# EAGLE design bodenfeuchte_1 (EAGLE 6.5.0)
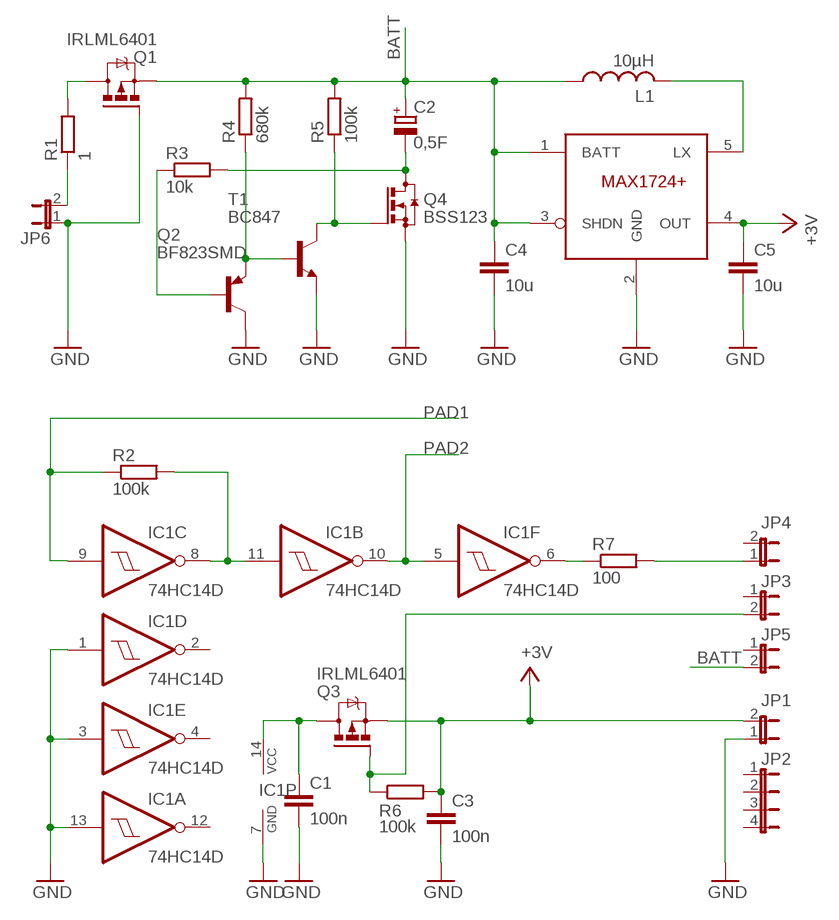
[diagram p0: schematic, sheet 1]

## Parts
C1  100n  C-EUC0805  [C0805]
C2  0,5F  CPOL-EUTAP5-80  [GOLDCAP5-21.5]
C3  100n  C-EUC0805  [C0805]
C4  10u  C-EUC0805  [C0805]
C5  10u  C-EUC0805  [C0805]
IC1  74HC14D  [SO14]
JP1  JP1E  [JP1]
JP2  JP4E  [JP4]
JP3  JP1E  [JP1]
JP4  JP1E  [JP1]
JP5  JP1E  [JP1]
JP6  JP1E  [JP1]
L1  10µH  L-USL1812  [L1812]
Q1  IRLML6401  IRLML5203  [MICRO3]
Q2  BF823SMD  [SOT23-BEC]
Q3  IRLML6401  IRLML5203  [MICRO3]
Q4  BSS123  [SOT23]
R1  1  R-EU_R0805  [R0805]
R2  100k  R-EU_R0805  [R0805]
R3  10k  R-EU_R0805  [R0805]
R4  680k  R-EU_R0805  [R0805]
R5  100k  R-EU_R0805  [R0805]
R6  100k  R-EU_R0805  [R0805]
R7  100  R-EU_R0805  [R0805]
T1  BC847  [SOT23]
U$1  MAX1724  [SOT23-5L]

## Nets
BATT: C2.+ C4.1 JP5.2 L1.1 Q1.2(S) R4.2 R5.2 U$1.1(BATT) U$1.3(SHDN)
GND: C1.2 C3.2 C4.2 C5.2 IC1.1(D:I) IC1.3(E:I) IC1.7(P:GND) IC1.13(A:I) JP1.1 JP6.1 Q1.1(G) Q2.C Q4.2(S) T1.2(E) U$1.2(GND)
N$2: IC1.8(C:O) IC1.11(B:I) R2.2
N$4: IC1.6(F:O) R7.1
N$5: JP4.1 R7.2
N$7: JP3.2 Q3.1(G) R6.1
N$8: C1.1 IC1.14(P:VCC) Q3.3(D)
N$11: Q4.1(G) R5.1 T1.3(C)
N$12: Q2.E R4.1 T1.1(B)
N$13: C2.- Q4.3(D) R3.2
N$14: Q2.B R3.1
N$15: JP6.2 R1.1
N$16: Q1.3(D) R1.2
N$21: L1.2 U$1.5(LX)
PAD1: IC1.9(C:I) R2.1
PAD2: IC1.5(F:I) IC1.10(B:O)
V+: C3.1 C5.1 JP1.2 Q3.2(S) R6.2 U$1.4(OUT) ; supply symbol labelled +3V
Unconnected: IC1.2(D:O) IC1.4(E:O) IC1.12(A:O) JP2.1 JP2.2 JP2.3 JP2.4 JP3.1 JP4.2 JP5.1

## Library data of the parts
C1 C3 = resistor:C-EU: CAPACITOR, European symbol
C2 = resistor:CPOL-EU: POLARIZED CAPACITOR, European symbol
C4 C5 = rcl:C-EU: CAPACITOR, European symbol
IC1 = 74xx-eu:74*14: Hex schmitt trigger INVERTER
JP1 JP3-JP6 = jumper:JP1E: JUMPER
JP2 = jumper:JP4E: JUMPER
L1 = resistor:L-US: INDUCTOR, American symbol
Q1 Q3 = transistor-power:IRLML5203: HEXFET P-Channel Power MOSFET
Q2 = transistor-pnp:BF823*: PNP Transistror
Q4 = transistor-small-signal:BSS123: N-CHANNEL MOS FET
R1-R7 = resistor:R-EU_: RESISTOR, European symbol
T1 = transistor-neu-to92:BC847: NPN TRANSISTOR
U$1 = MAX1724:MAX1724

## Board
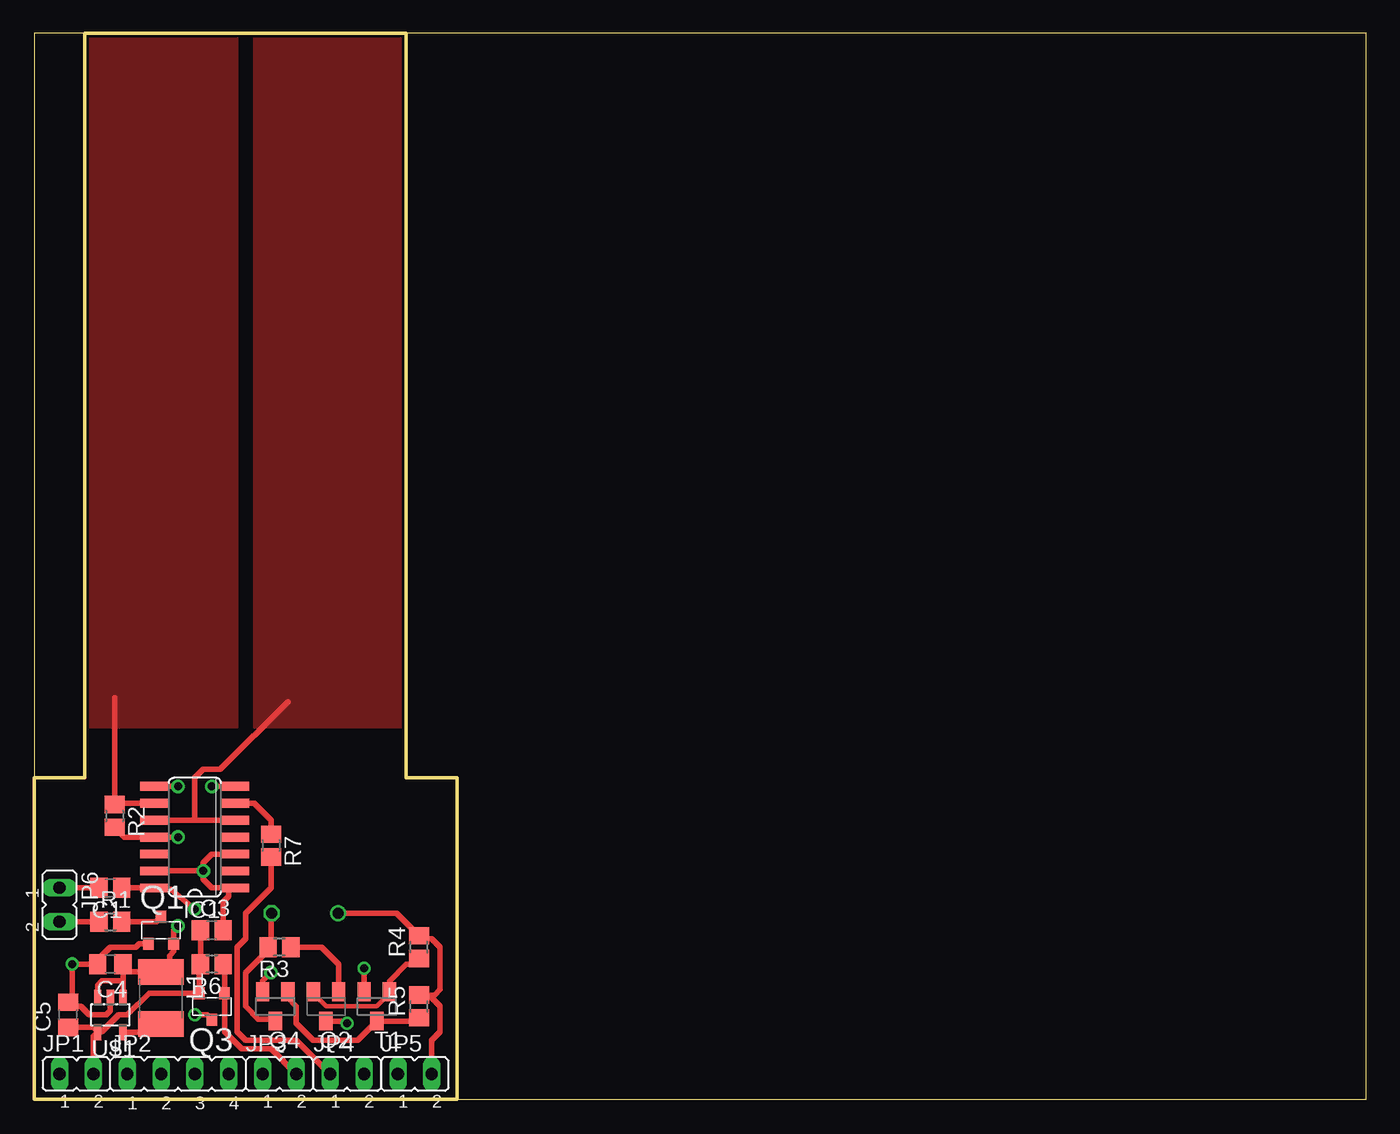
[diagram p1: board, top side]
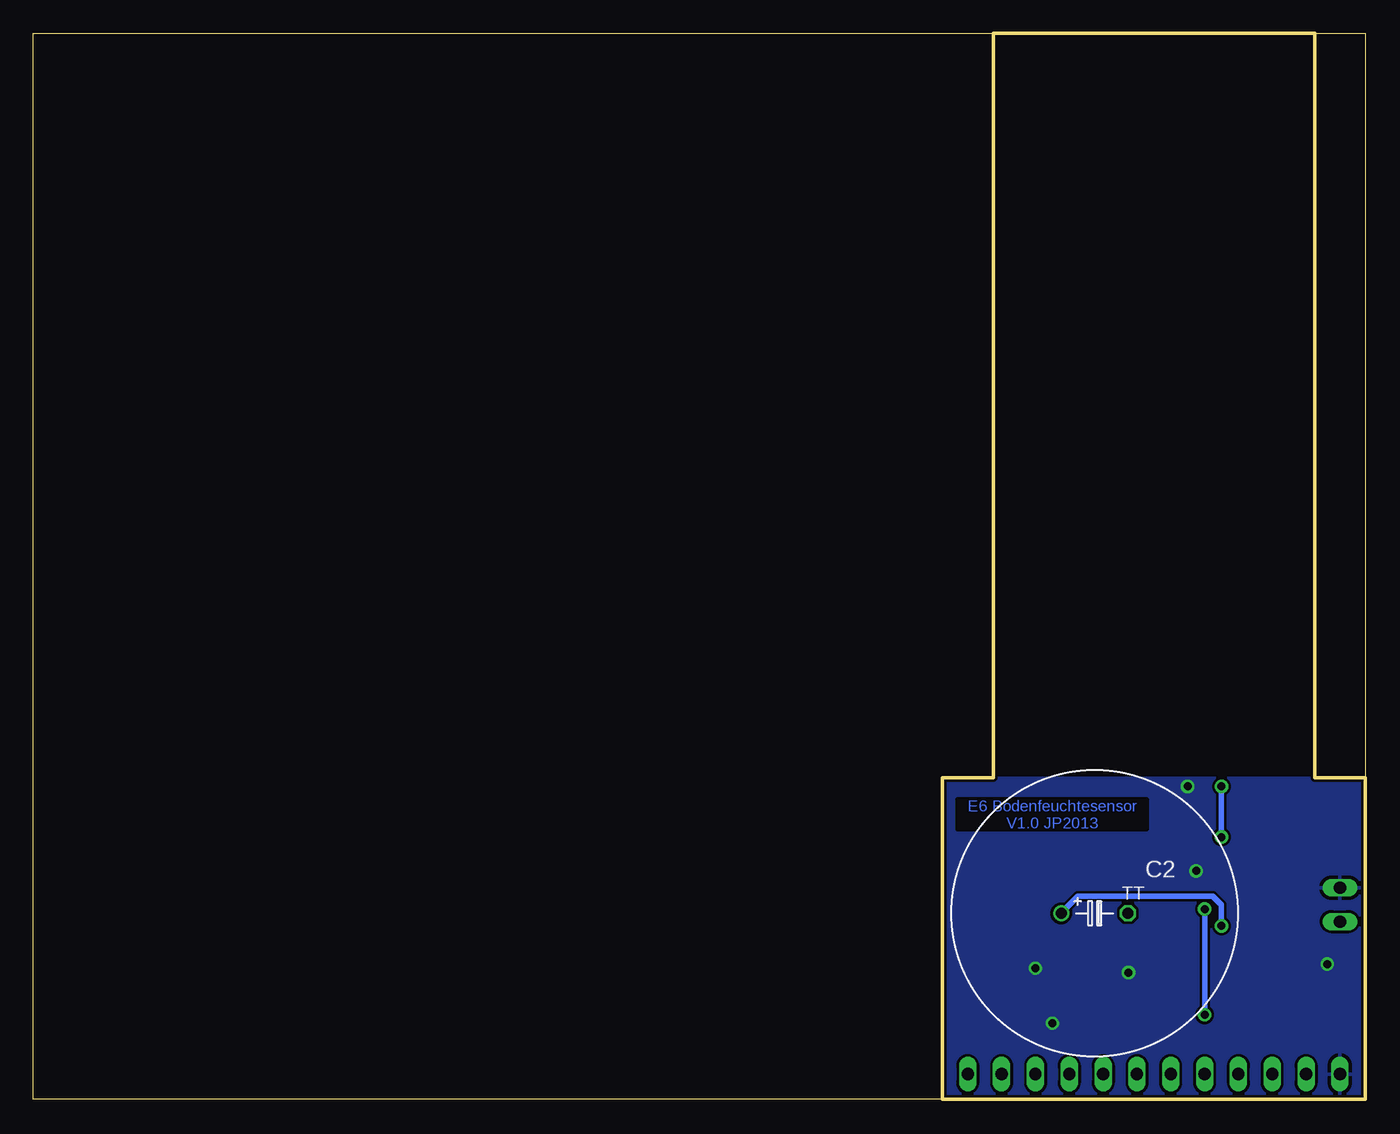
[diagram p2: board, bottom side, seen from below]

Size 100 x 80.01 mm. Coordinates in mm from the lower left corner, seen from the top.
Outline: 31.75,0 100,0 100,80 0,80 0,24.13
Outline: 0,24.13 0,0 31.75,0
Outline: 31.75,0 31.75,24.13 27.94,24.13 27.94,80.01 3.81,80.01 3.81,24.13 0,24.13
Copper layers (1*16): Top 0.035mm / dielectric 1.5mm / Bottom 0.035mm
Design rules "ZWILLING": minimum track width 0.2mm, minimum drill 0.5mm, track to track 0.2mm, track to pad 0.2mm, pad to pad 0.15mm, via to via 0.2mm, smd to smd 0mil, copper to edge 0.2mm, drill to drill 0.2mm, minimum pad ring 0.2mm, minimum via ring 0.2mm, stop-mask expansion 0.1mm, vias tented up to drill 0mil, thermal gap 10mil

### Footprints (pad centres in the part's own frame; a part is rotated, then mirrored left to right if it is on the bottom)
C0805 = smd 1.3 x 1.5: 1 -0.85,0; 2 0.85,0
GOLDCAP5-21.5 = drill 0.813: + -2.499,0 | drill 0.813 octagon: - 2.499,0
C0805' = smd 1.3 x 1.5: 1 -0.95,0; 2 0.95,0
SO14 = smd 0.66 x 2.032: 1 -3.81,-3.073; 2 -2.54,-3.073; 3 -1.27,-3.073; 4 0,-3.073; 5 1.27,-3.073; 6 2.54,-3.073; 7 3.81,-3.073; 8 3.81,3.073; 9 2.54,3.073; 10 1.27,3.073; 11 0,3.073; 12 -1.27,3.073; 13 -2.54,3.073; 14 -3.81,3.073
JP1 = drill 0.914 long: 1 0,-1.27; 2 0,1.27
JP4 = drill 0.914 long: 1 -3.81,0; 2 -1.27,0; 3 1.27,0; 4 3.81,0
L1812 = smd 1.9 x 3.4: 1 -1.95,0; 2 1.95,0
MICRO3 = smd 0.8 x 0.9: 1 -0.95,-1; 2 0.95,-1; 3 0,1
SOT23-BEC = smd 1 x 1.4: B -0.95,-1.1; C 0,1.1; E 0.95,-1.1
SOT23 = smd 1 x 1.4: 1 -0.95,-1.1; 2 0.95,-1.1; 3 0,1.1
R0805 = smd 1.3 x 1.5: 1 -0.85,0; 2 0.85,0
SOT23-5L = smd 0.55 x 1.2: 1 -0.95,-1.3; 2 0,-1.3; 3 0.95,-1.3; 4 0.95,1.3; 5 -0.95,1.3

### Placement (x,y rotation side)
C1  5.71,15.88 180 top
C2  20.32,13.97 0 bottom
C3  13.34,12.7 0 top
C4  10u  [C0805']  5.71,10.16 180 top
C5  10u  [C0805']  2.54,6.35 90 top
IC1  12.06,19.68 90 top
JP1  3.17,1.91 270 top
JP2  10.79,1.91 0 top
JP3  18.41,1.91 270 top
JP4  23.5,1.91 270 top
JP5  28.57,1.91 270 top
JP6  1.91,14.61 180 top
L1  9.53,7.62 270 top
Q1  9.53,12.7 0 top
Q2  21.91,6.99 180 top
Q3  13.34,6.99 180 top
Q4  18.1,6.99 180 top
R1  5.71,13.34 0 top
R2  6.03,21.27 270 top
R3  18.41,11.43 180 top
R4  28.89,11.43 90 top
R5  28.89,6.99 90 top
R6  13.34,10.16 180 top
R7  17.78,19.05 270 top
T1  25.72,6.99 180 top
U$1  5.71,6.35 180 top

### Tracks (layer width: path | path; a pad name or v marks a point on that pad's centre or on a via)
BATT  (via drill 0.6)
  Top 0.406: U$1.3 4.76,8.57 5.08,8.89 6.67,8.89 | U$1.1 6.67,8.89 | 6.67,8.89 C4.1 7.25,9.57 L1.1 10.16,10.21 10.16,10.79 10.47,11.11 Q1.2 10.47,12.7 v10.79,13.02 | JP5.2 29.84,4.45 30.48,5.08 30.48,6.99 29.84,7.62 29.11,7.62 R5.2 30.06,7.83 30.48,8.26 30.48,11.43 29.84,12.06 29.11,12.06 R4.2 27.2,13.97 C2.+
  Bottom 0.406: v10.79,13.02 10.79,14.61 11.43,15.24 21.59,15.24 22.82,14.01 C2.+
GND  (via drill 0.6)
  Top 0.406: Q2.C 23.32,5.88 v23.5,5.71 | T1.2 24.77,9.21 v24.77,9.84 | U$1.2 5.71,6.67 5.4,6.35 4.13,6.35 3.49,6.99 2.85,6.99 C5.2 2.86,7.62 v2.86,10.16 C4.2 5.08,10.47 5.08,10.79 5.71,11.43 7.62,11.43 7.89,11.7 Q1.1 | IC1.1 14.61,15.88 | 14.61,15.88 13.34,15.88 12.7,16.51 v12.7,17.14 | v12.7,17.14 12.7,17.78 13.34,18.41 IC1.3 | IC1.13 v12.7,17.14 | C3.2 14.19,14.82 14.61,15.24 14.61,15.88 | IC1.7 v13.34,23.5 | Q4.2 17.15,8.89 v17.78,9.53 | JP6.1 C1.2
  pour Bottom: 0,24.13 0,0 31.75,0 31.75,24.13
N$2  (via drill 0.6)
  Top 0.406: R2.2 6.77,19.68 IC1.11 v10.79,19.68 | v10.79,23.5 IC1.8
  Bottom 0.406: v10.79,19.68 v10.79,23.5
N$4
  Top 0.406: R7.1 17.78,20.95 16.51,22.23 IC1.6
N$5
  Top 0.406: JP4.1 19.68,4.45 15.88,4.45 15.24,5.08 15.24,11.43 15.88,12.06 15.88,13.97 17.78,15.88 R7.2
N$7
  Top 0.406: R6.1 14.29,9.43 Q3.1 14.29,6.04 14.29,5.4 14.29,5.08 15.56,3.81 17.78,3.81 JP3.2
N$8  (via drill 0.6)
  Top 0.406: v12.06,14.29 10.26,15.77 IC1.14 C1.1 | v12.06,6.35 12.97,6.35 Q3.3
  Bottom 0.406: v12.06,14.29 v12.06,6.35
N$11
  Top 0.406: R5.1 28.64,5.88 T1.3 24.28,4.45 20.95,4.45 19.68,5.71 19.68,6.99 19.05,7.62 Q4.1
N$12
  Top 0.356: 26.67,7.93 25.72,6.99 21.91,6.99 21.27,7.62
  Top 0.406: 26.67,7.93 T1.1 26.67,8.89 27.94,10.16 28.47,10.16 R4.1 | 21.27,7.62 21.27,7.77 Q2.E
N$13
  Top 0.406: C2.- 17.78,13.97 17.78,11.01 R3.2 17.14,10.79 15.88,9.53 15.88,6.99 16.83,6.03 17.95,6.03 Q4.3
N$14
  Top 0.406: R3.1 21.59,11.43 22.86,10.16 Q2.B
N$15
  Top 0.406: JP6.2 R1.1
N$16
  Top 0.406: R1.2 9.16,13.34 Q1.3
N$21
  Top 0.406: U$1.5 8.9,5.05 L1.2
PAD1
  Top 0.406: IC1.9 6.77,22.23 R2.1 6.03,30.16
  pour Top: 3.81,80.01 15.24,80.01 15.24,27.94 3.81,27.94
PAD2
  Top 0.406: IC1.5 12.06,20.95 | 12.06,20.95 IC1.10 | 19.05,29.84 13.97,24.77 12.7,24.77 12.06,24.13 12.06,20.95
  pour Top: 16.51,80.01 27.94,80.01 27.94,27.94 16.51,27.94
V+
  Top 0.406: C5.1 4.42,5.4 U$1.4 | C3.1 R6.2 12.38,9.43 Q3.2 8.62,7.99 6.99,6.35 6.35,6.35 5.08,5.08 4.79,5.08 U$1.4 | JP1.2 4.45,4.73 U$1.4

### Text on the board
Bottom: E6 Bodenfeuchtesensor / V1.0 JP2013